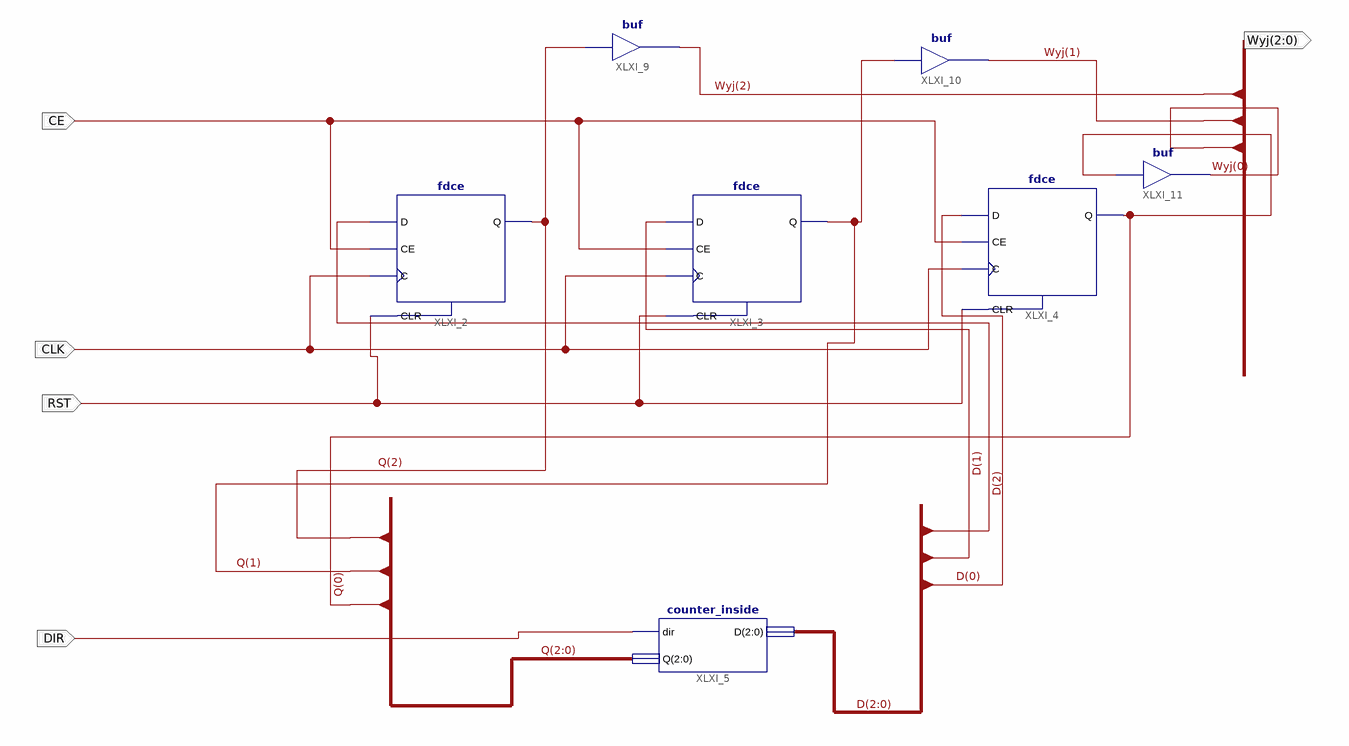
[diagram p0: schematic sheet 1]
// Xilinx ISE schematic counter.sch (xc9500xl) as structural Verilog: 7 symbols, 5 ports
module counter (
  input  DIR,
  input  RST,
  input  CLK,
  input  CE,
  output [2:0] Wyj
);

  wire [2:0] D, Q;

  fdce XLXI_2 (.C(CLK), .CE(CE), .CLR(RST), .D(D[2]), .Q(Q[2]));
  fdce XLXI_3 (.C(CLK), .CE(CE), .CLR(RST), .D(D[1]), .Q(Q[1]));
  fdce XLXI_4 (.C(CLK), .CE(CE), .CLR(RST), .D(D[0]), .Q(Q[0]));
  counter_inside XLXI_5 (.dir(DIR), .Q(Q), .D(D));
  buf XLXI_9 (Wyj[2], Q[2]);
  buf XLXI_10 (Wyj[1], Q[1]);
  buf XLXI_11 (Wyj[0], Q[0]);
endmodule
